# Altium schematic sheet ATmega4809_Curiosity_Nano_Target_MCU.SchDoc
size A3; SheetTitle: Target MCU; CompanyName: Microchip Technology Inc.; Organization: Microchip Technology; Address1: 2355 West Chandler Blvd.; Address2: Chandler, AZ  85224; Address4: USA; SheetNumber: 2; SheetTotal: 4; Time: Time
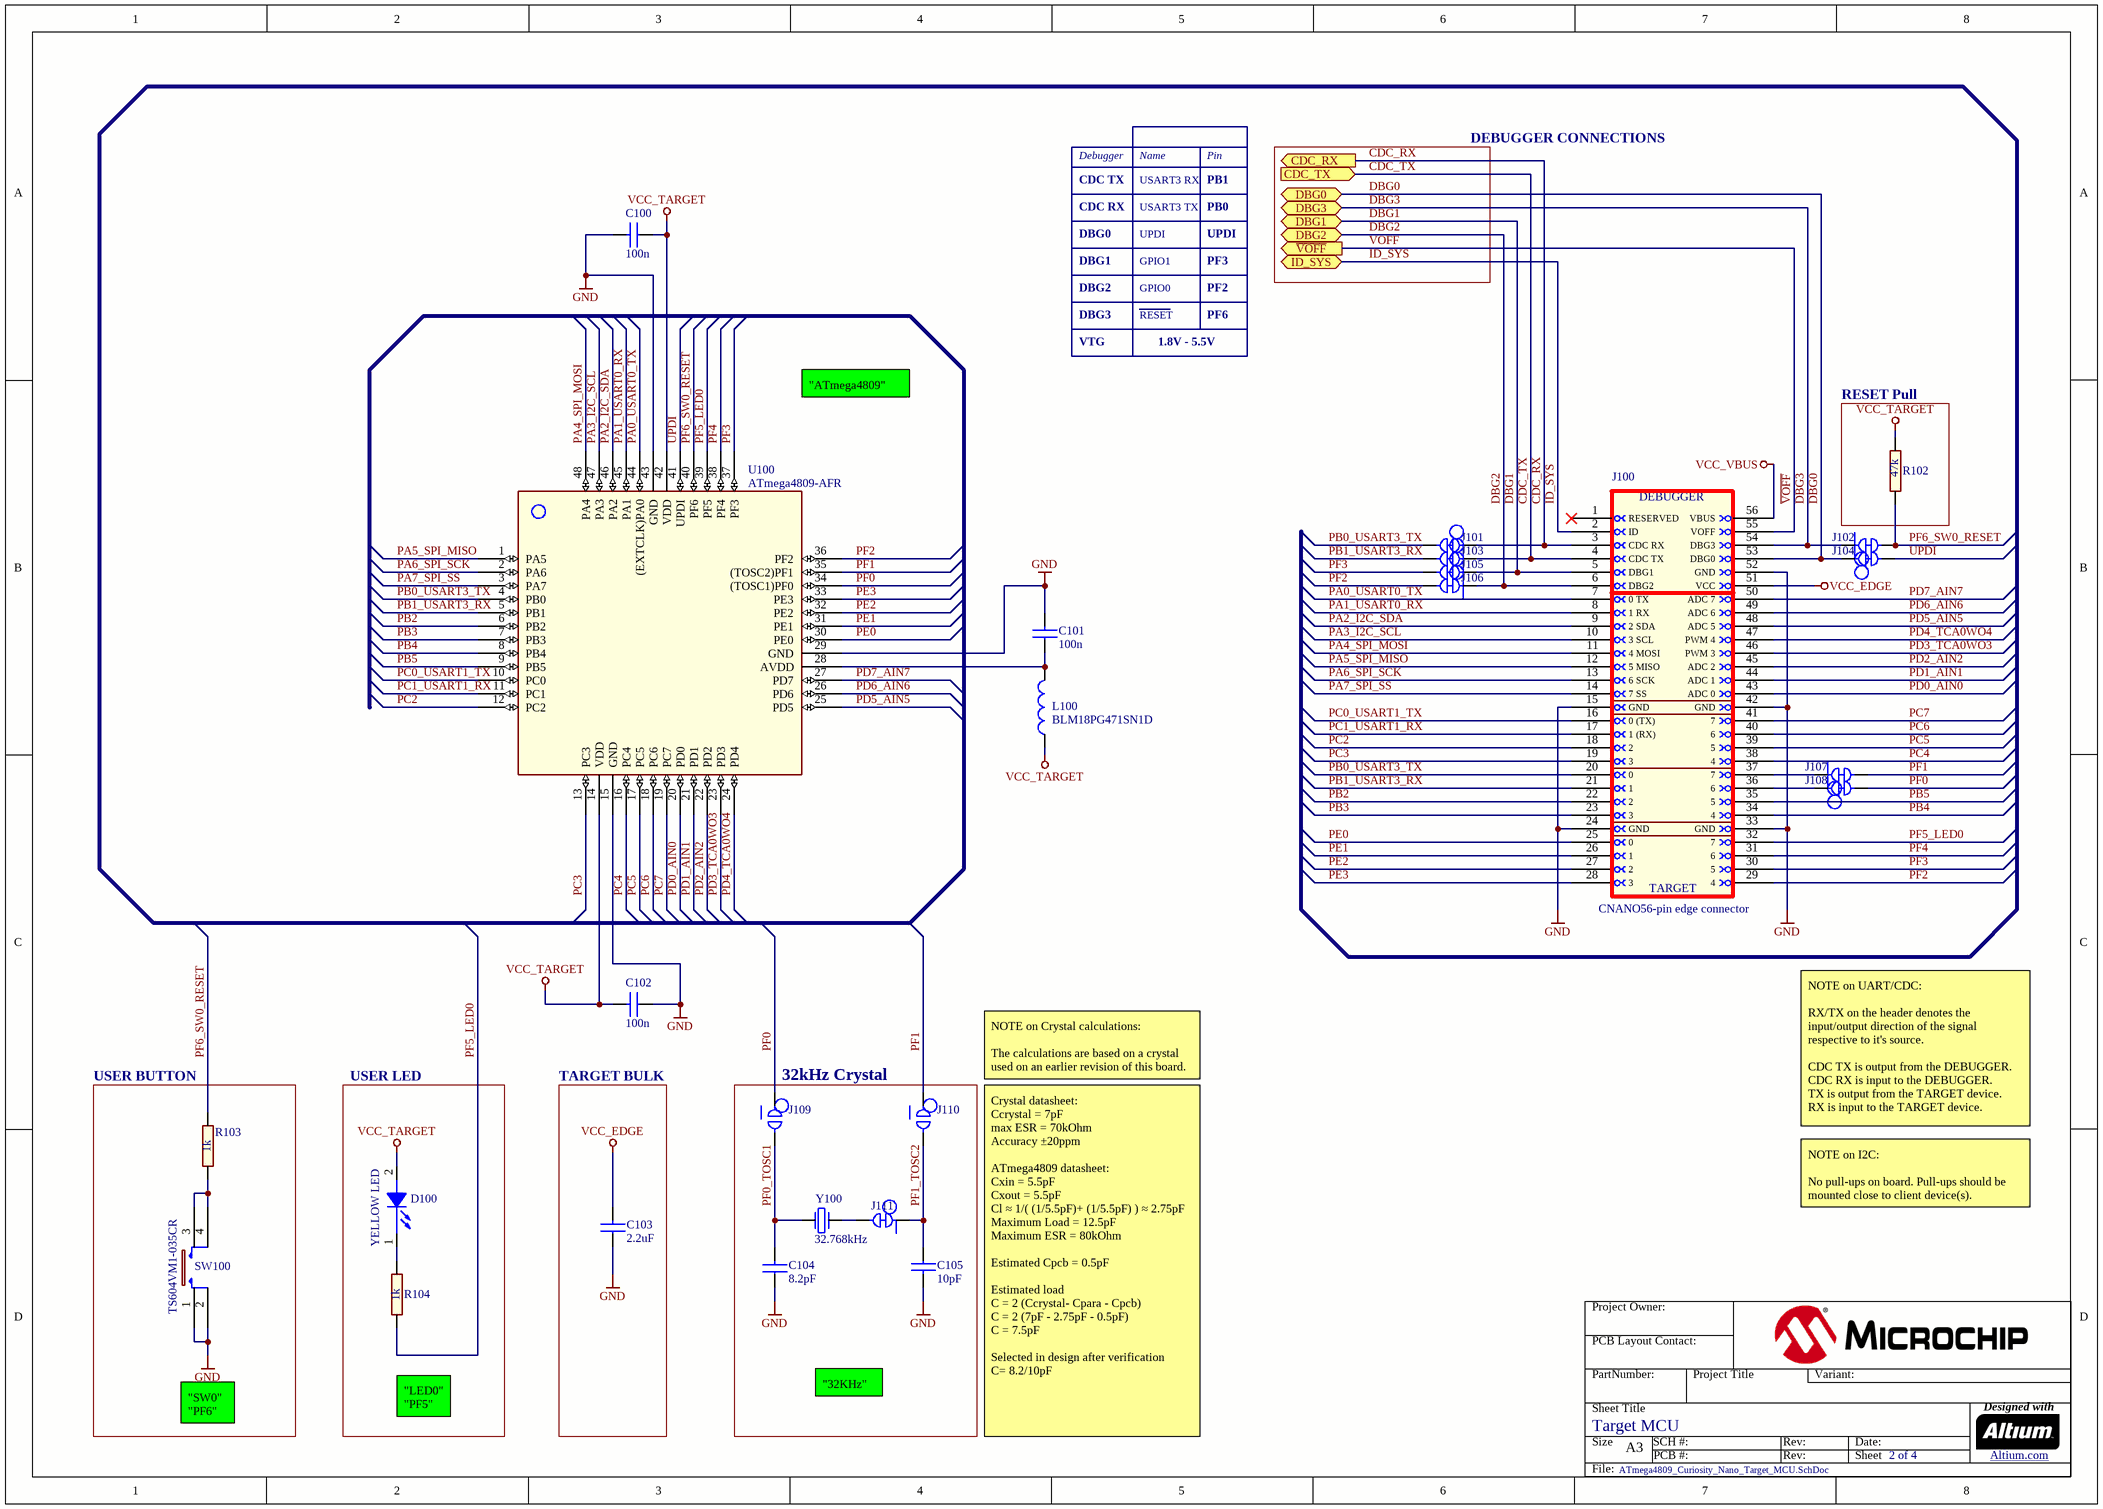
[diagram p0: ATmega4809_Curiosity_Nano_Target_MCU.SchDoc]

## Parts
C100  value 100n  [AP1-00148]
C101  value 100n  [AP1-00148]
C102  value 100n  [AP1-00148]
C103  value 2.2uF  [AP1-00148]
C104  value 8.2pF  [AP1-00141]  (hidden comment: RFA-C)
C105  value 10pF  [AP1-00038]
D100  value YELLOW LED  [AP4-00169]
J100  value CNANO56-pin edge connector  [AP8-01100]  (no BOM)
J101  (no value)  [AP8-01166]  (net tie, no BOM)
J102  (no value)  [AP8-01166]  (net tie, no BOM)
J103  (no value)  [AP8-01166]  (net tie, no BOM)
J104  (no value)  [AP8-01166]  (net tie, no BOM)
J105  (no value)  [AP8-01166]  (net tie, no BOM)
J106  (no value)  [AP8-01166]  (net tie, no BOM)
J107  (no value)  [AP8-01166]  (net tie, no BOM)
J108  (no value)  [AP8-01166]  (net tie, no BOM)
J109  (no value)  [AP9-00172]  (no BOM)
J110  (no value)  [AP9-00172]  (no BOM)
J111  (no value)  [AP8-00595]  (net tie, no BOM)
L100  value BLM18PG471SN1D  [AP3-00005]  (hidden comment: part number either has "D" (tape and reel) or "B" (Bulk) at the end.)
R102  value 47k  [AP2-00108]
R103  value 1k  [AP2-00108]
R104  value 1k  [AP2-00108]
SW100  value TS604VM1-035CR  [AP8-00137]  (hidden comment: Rating: DC 12V 50mA / Max 0.1 ohm contact resistance)
U100  value ATmega4809-AFR  [AP6-00357]
Y100  value 32.768kHz  [AP7-00069]

## Blocks framed on the sheet
RESET Pull: R102
USER BUTTON: R103 SW100
USER LED: D100 R104
TARGET BULK: C103
32kHz Crystal: C104 C105 J109-J111 Y100

## Ports
CDC_RX (out), CDC_TX (in), DBG0 (bidir), DBG1 (bidir), DBG2 (bidir), DBG3 (bidir), ID_SYS (bidir), ~{VOFF} (out)

## Nets
GND: C100.2 C101.2 C102.1 C103.1 C104.1 C105.2 J100.15(GND) J100.24(GND) J100.33(GND) J100.42(GND) J100.52(GND) SW100.1 SW100.2 U100.15(GND) U100.29(GND) U100.43(GND)
VCC_EDGE: C103.2 J100.51(VCC)
VCC_TARGET: C100.1 C102.2 D100.2(ANODE) L100.1 R102.2 U100.14(VDD) U100.42(VDD)
VCC_VBUS: J100.56(VBUS)
CDC_RX: J100.3(CDC_RX) J101.1 ; port CDC_RX
CDC_TX: J100.4(CDC_TX) J103.1 ; port CDC_TX
DBG0: J100.53(DBG0) J104.1 ; port DBG0
DBG1: J100.5(DBG1) J105.1 ; port DBG1
DBG2: J100.6(DBG2) J106.1 ; port DBG2
DBG3: J100.54(DBG3) J102.1 ; port DBG3
ID_SYS: J100.2(ID) ; port ID_SYS
PA0_USART0_TX: J100.7(0_TX) U100.44((EXTCLK)PA0)
PA1_USART0_RX: J100.8(1_RX) U100.45(PA1)
PA2_I2C_SDA: J100.9(2_SDA) U100.46(PA2)
PA3_I2C_SCL: J100.10(3_SCL) U100.47(PA3)
PA4_SPI_MOSI: J100.11(4_MOSI) U100.48(PA4)
PA5_SPI_MISO: J100.12(5_MISO) U100.1(PA5)
PA6_SPI_SCK: J100.13(6_SCK) U100.2(PA6)
PA7_SPI_SS: J100.14(7_SS) U100.3(PA7)
PB0_USART3_TX: J100.20(0) J101.2 U100.4(PB0)
PB1_USART3_RX: J100.21(1) J103.2 U100.5(PB1)
PB2: J100.22(2) U100.6(PB2)
PB3: J100.23(3) U100.7(PB3)
PB4: J100.34(4) U100.8(PB4)
PB5: J100.35(5) U100.9(PB5)
PC0_USART1_TX: J100.16(0_(TX)) U100.10(PC0)
PC1_USART1_RX: J100.17(1_(RX)) U100.11(PC1)
PC2: J100.18(2) U100.12(PC2)
PC3: J100.19(3) U100.13(PC3)
PC4: J100.38(4) U100.16(PC4)
PC5: J100.39(5) U100.17(PC5)
PC6: J100.40(6) U100.18(PC6)
PC7: J100.41(7) U100.19(PC7)
PD0_AIN0: J100.43(ADC_0) U100.20(PD0)
PD1_AIN1: J100.44(ADC_1) U100.21(PD1)
PD2_AIN2: J100.45(ADC_2) U100.22(PD2)
PD3_TCA0WO3: J100.46(PWM_3) U100.23(PD3)
PD4_TCA0WO4: J100.47(PWM_4) U100.24(PD4)
PD5_AIN5: J100.48(ADC_5) U100.25(PD5)
PD6_AIN6: J100.49(ADC_6) U100.26(PD6)
PD7_AIN7: J100.50(ADC_7) U100.27(PD7)
PE0: J100.25(0) U100.30(PE0)
PE1: J100.26(1) U100.31(PE1)
PE2: J100.27(2) U100.32(PE2)
PE3: J100.28(3) U100.33(PE3)
PF0: J108.2 J109.1 U100.34((TOSC1)PF0)
PF0_TOSC1: C104.2 J109.2 Y100.1
PF1: J107.2 J110.1 U100.35((TOSC2)PF1)
PF1_TOSC2: C105.1 J110.2 J111.1
PF2: J100.29(4) J106.2 U100.36(PF2)
PF3: J100.30(5) J105.2 U100.37(PF3)
PF4: J100.31(6) U100.38(PF4)
PF5_LED0: J100.32(7) R104.1 U100.39(PF5)
PF6_SW0_RESET: J102.2 R102.1 R103.1 U100.40(PF6)
UPDI: J104.2 U100.41(UPDI)
~{VOFF}: J100.55(VOFF) ; port ~{VOFF}
NetC101_1: C101.1 L100.2 U100.28(AVDD)
NetD100_1: D100.1(CATHODE) R104.2
NetJ100_36: J100.36(6) J108.1
NetJ100_37: J100.37(7) J107.1
NetJ111_2: J111.2 Y100.2
NetR103_2: R103.2 SW100.3 SW100.4

Not connected (* = marked no-connect by the designer): J100 1(RESERVED)*

## Notes on the sheet
- Debugger
- CDC TX
- USART3 RX
- Name
- PB1
- Pin
- DEBUGGER CONNECTIONS
- DBG0
- CDC RX
- UPDI
- USART3 TX
- PB0
- DBG1
- DBG2
- DBG3
- GPIO1
- GPIO0
- RESET
- PF3
- PF2
- PF6
- VTG
- 1.8V - 5.5V
- "ATmega4809"
- NOTE on Crystal calculations:
  The calculations are based on a crystal used on an earlier revision of this board.
- NOTE on UART/CDC:
  RX/TX on the header denotes the input/output direction of the signal respective to it's source.
  CDC TX is output from the DEBUGGER.
  CDC RX is input to the DEBUGGER.
  TX is output from the TARGET device.
  RX is input to the TARGET device.
- NOTE on I2C:
  No pull-ups on board. Pull-ups should be mounted close to client device(s).
- "32KHz"
- "SW0"
  "PF6"
- "LED0"
  "PF5"
- Crystal datasheet:
  Ccrystal = 7pF
  max ESR = 70kOhm
  Accuracy ±20ppm
  ATmega4809 datasheet:
  Cxin = 5.5pF
  Cxout = 5.5pF
  Cl ≈ 1/( (1/5.5pF)+ (1/5.5pF) ) ≈ 2.75pF
  Maximum Load = 12.5pF
  Maximum ESR = 80kOhm
  Estimated Cpcb = 0.5pF
  Estimated load
  C = 2 (Ccrystal- Cpara - Cpcb)
  C = 2 (7pF - 2.75pF - 0.5pF)
  C = 7.5pF
  Selected in design after verification
  C= 8.2/10pF
- Project Owner:
- PCB Layout Contact:
- PartNumber:
- Project Title
- Variant:
- Sheet Title
- Size
- A3
- SCH #:
- PCB #:
- Rev:
- Date:
- Sheet
- Designed with
- Altium.com <http://go.altium.com/MicrochipLandingPage_Evaluation.html>
- File:
- (in symbol A08-2840) DEBUGGER; TARGET

## Library data of the parts
C100-C102 = A01-0246: Ceramic capacitor, SMD 0402, X7R, 16V, +/-10%; PartGroup: Capacitors,Ceramic,SMD 0402; Manufacturer: Yageo; MPN: CC0402KRX7R7BB104; TemperatureRange: -55 - +125 deg C; Tolerance: 16V, +/-10%; AN: A01-0246; Height: 0.5
C103 = A01-0493: CAP CER 2.2UF 10V 10% X5R 0402; PartGroup: Capacitors,Ceramic,SMD 0402; Manufacturer: TDK; MPN: C1005X5R1A225K050BC; Tolerance: +/-10%; TemperatureRange: -55 to 85C; AN: A01-0493; Height: 0.5
C104 = A01-0803: 8.2pF GCQ15 Series HiQ Automotive 0402(EIA); PartGroup: Capacitors,Ceramic,SMD 0402; Manufacturer: Murata; MPN: GCQ1555C1H8R2D; Tolerance: +/-0.5; AN: A01-0803; Height: 0.5
C105 = A01-0356: Ceramic capacitor, SMD 0402, NP0, 50V, +/-5% (de16674); PartGroup: Capacitors,Ceramic,SMD 0402; Manufacturer: Yageo; MPN: CC0402JRNPO9BN100; Tolerance: 5%; TemperatureRange: -55 - +125 deg C; AN: A01-0356
D100 = A10-0218: LED, SMD 0603, Yellow, Wave length=590nm, 100mcd @ (20mA, 2.2Vf) rohm; PartGroup: Opto,LEDs,SMD; MPN: SML-D12Y1WT86; TemperatureRange: -40 to +85; AN: A10-0218; Height: 0.550000011920929; Manufacturer: ROHM
J100 = A08-2840: Curiosity Nano 56-pin edge connector with castellations, 100-mil pitch.; PartGroup: Mechanical devices,Connectors,Pin headers; AN: A08-2840
J101-J108 = A08-2981: Closed Link 0402 w/50mil hole; PartGroup: Mechanical devices,PCB implemented components; Value: Closed Link; AN: A08-2981
J109 J110 = A08-2866: 1x1mm, Round Strap, Open, no frame; PartGroup: Mechanical devices,PCB implemented components; Value: SOLDER-STRAP_OPEN; AN: A08-2866; Height: 0
J111 = A08-1454: Closed Link 0402; PartGroup: Mechanical devices,PCB implemented components; Value: Closed Link; AN: A08-1454
L100 = A03-0035: SMD RF inductor 0603. Z=470Ohm (@100MHz), Max R(dc)=0.20Ohm, Max current=1A; PartGroup: Inductors,EMI; Manufacturer: Murata; TemperatureRange: -55; AN: A03-0035; Height: 0.800000011920929; MPN: BLM18PG471SN1D
R102 = A02-0252: Thick film resistor, SMD 0402, 1/16W, 1%; PartGroup: Resistors,SMD,0402 1%; Manufacturer: KOA; MPN: RK73H1ETTP4702F; TemperatureRange: -55 - +125 deg C; Tolerance: 1 %; AN: A02-0252; Height: 0.349999994039536
R103 R104 = A02-0212: Thick film resistor, SMD 0402, 1/16W, 1%; PartGroup: Resistors,SMD,0402 1%; Manufacturer: Yageo; MPN: RC0402FR071KL; TemperatureRange: -55 - +125 deg C; Tolerance: 1 %; AN: A02-0212; Height: 0.349999994039536
SW100 = A08-2830: SWITCH, SMD, 260gf, 6.4mm X 6.2mm; PartGroup: Mechanical devices,Switches,SMD; Manufacturer: Dailywell Electronics Co.LTD; MPN: TS604VM1-035CR-R; TemperatureRange: -40 - +85 deg C; AN: A08-2830; Height: 3.5
U100 = A06-1553: Atmel 8-bit RISC MCU, 48K Flash, 48pin TQFP, 7x7mm, 0.5m pitch package; PartGroup: Integrated Circuits,MCU, MPU, DSP,AVR MCU; Manufacturer: Microchip; TemperatureRange: -40Â°C to +125Â°C; AN: A06-1553; MPN: ATmega4809-AFR
Y100 = A07-0171: Crystal, 32.768kHz, CL=9.0pF, ESR=70kOhm, SMD  LxW=3.2 x 1.5mm, 20ppm; PartGroup: Frequency devices,Crystals,SMD; Manufacturer: Microchip; MPN: VMK3-9001-32K7680000TR; TemperatureRange: -40 to 85C; AN: A07-0171; Tolerance: 20ppm; Height: 0.899999976158142